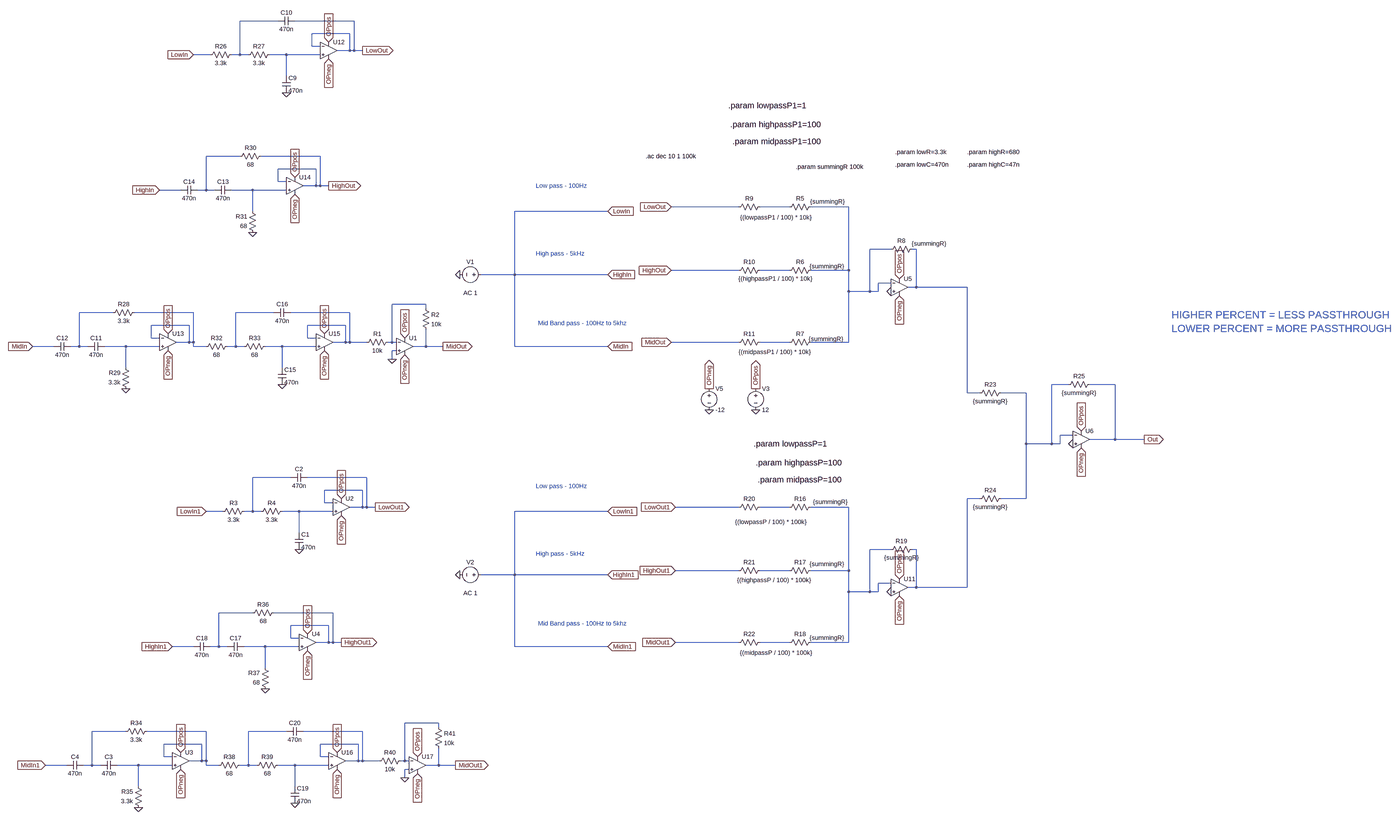
[diagram p0: schematic Analog 2 channel Audio Mixer.asc, whole sheet]
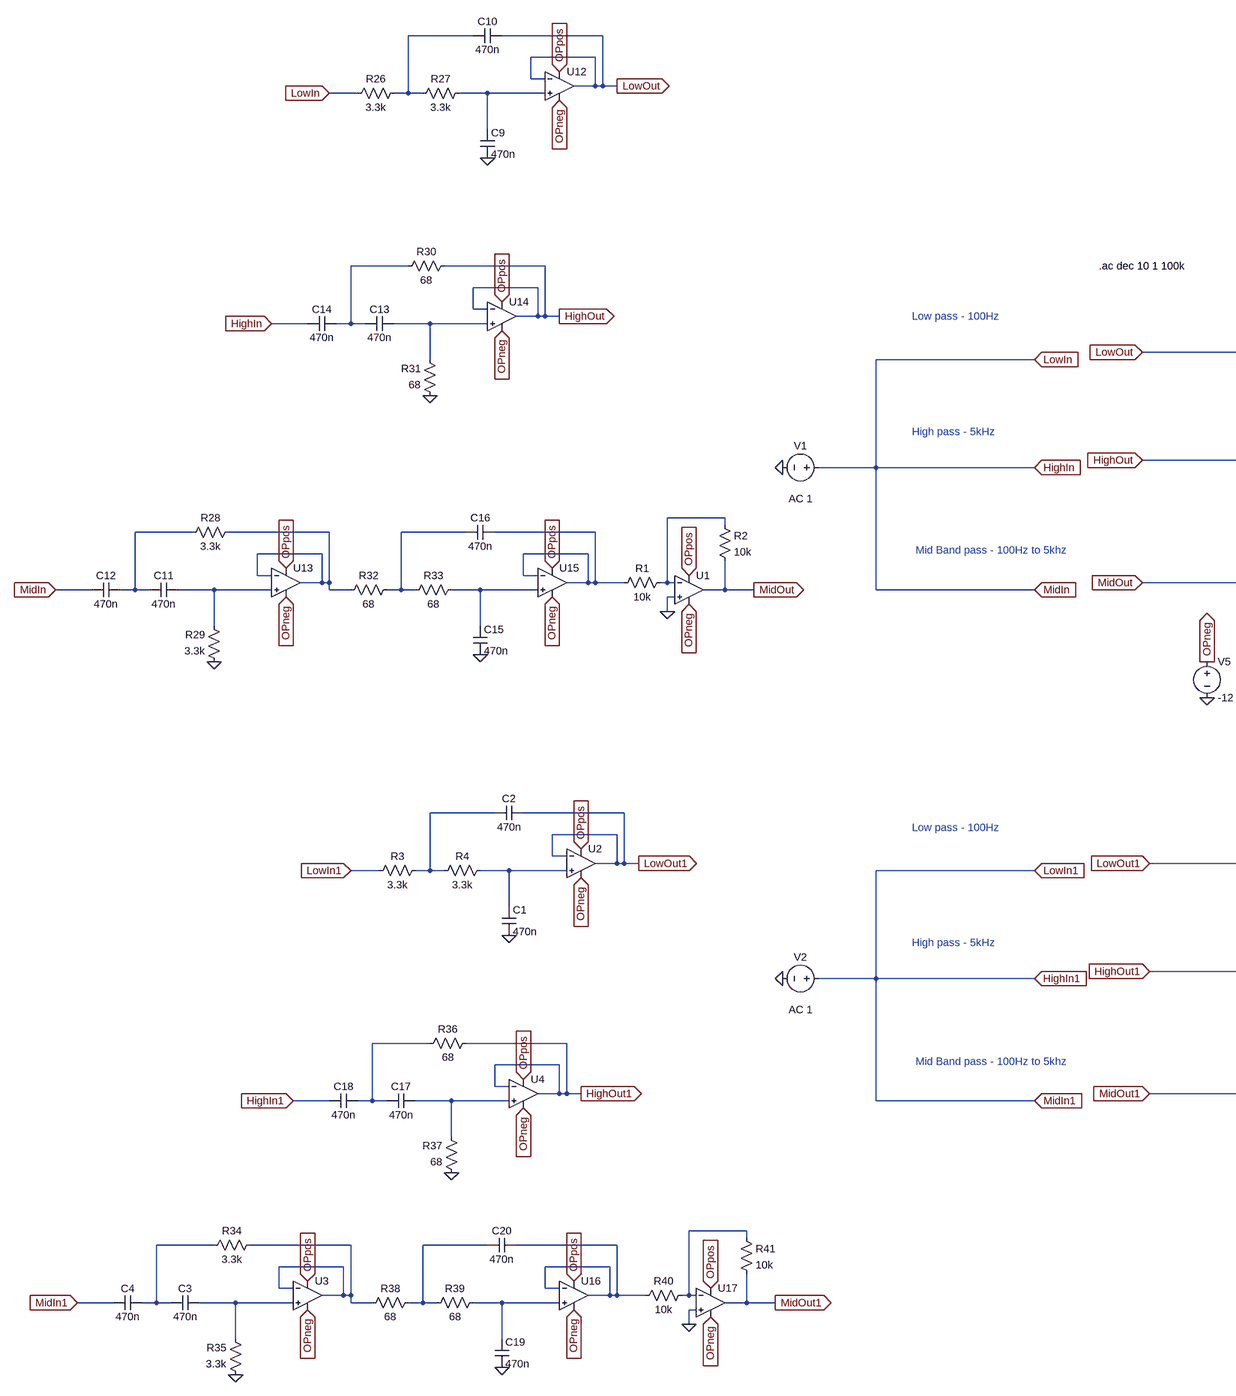
[diagram p1: schematic Analog 2 channel Audio Mixer.asc, part, row 1 of 1, column 1 of 2]
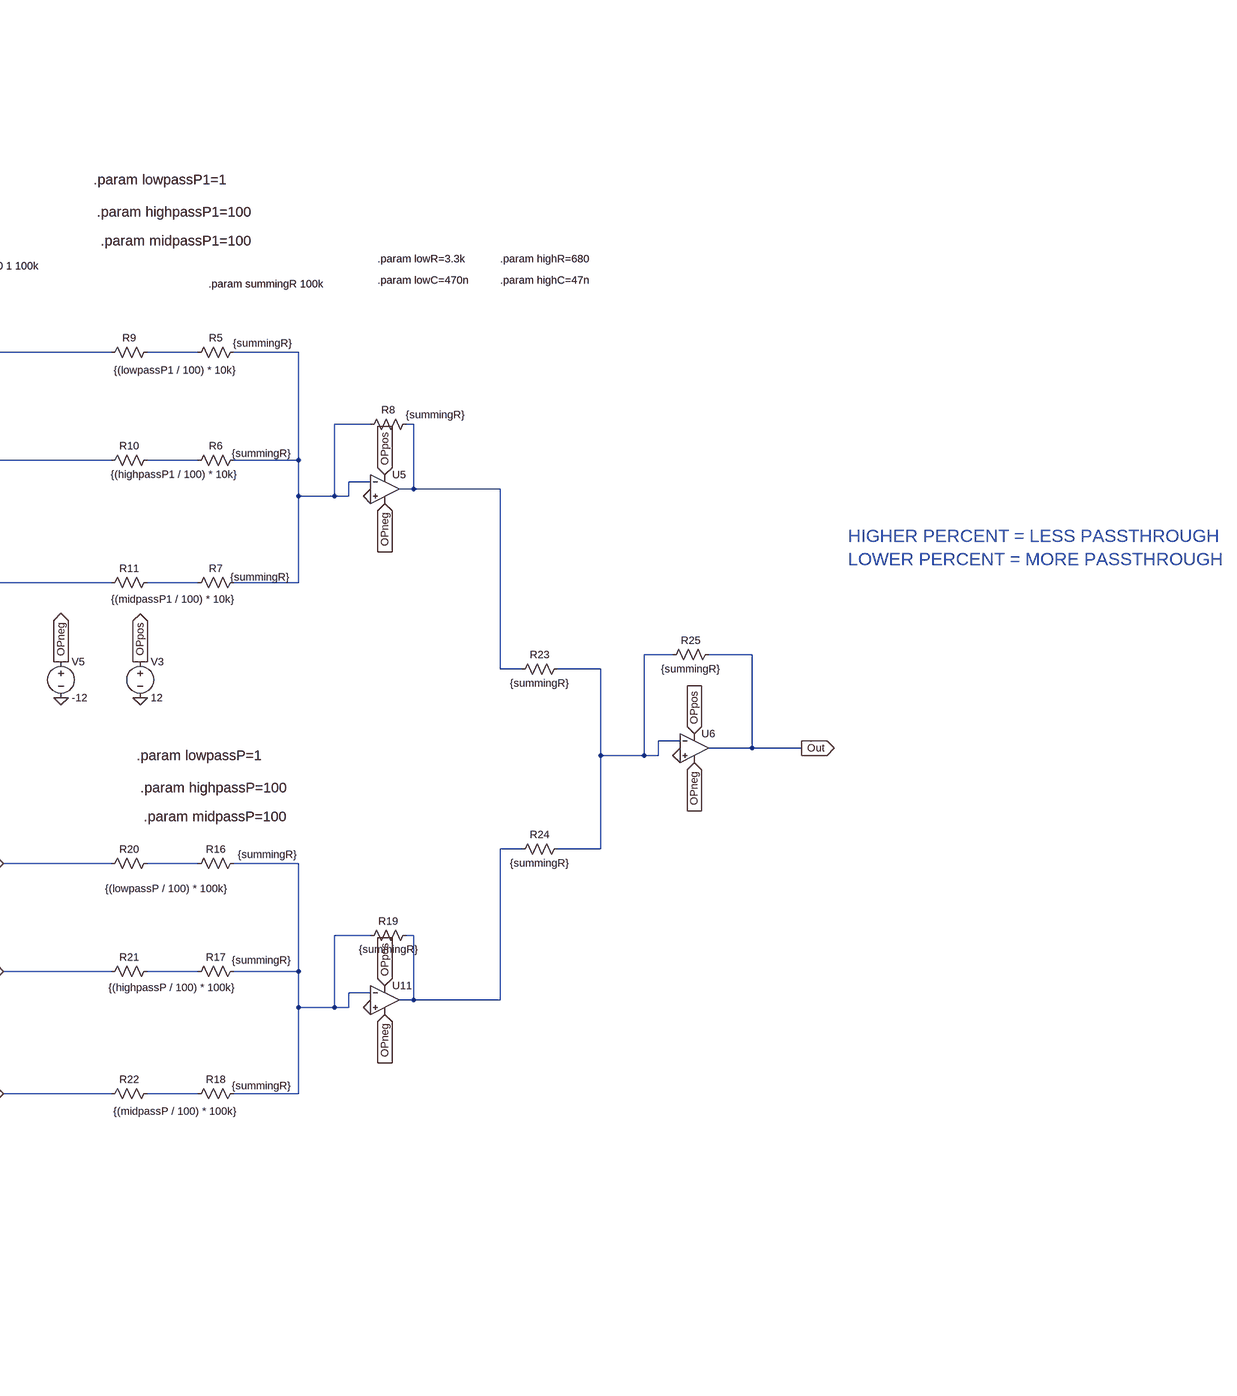
[diagram p2: schematic Analog 2 channel Audio Mixer.asc, part, row 1 of 1, column 2 of 2]
Analog 2 channel Audio Mixer.asc, the LTspice schematic file:
Version 4.1
SHEET 1 2996 2628
WIRE -1248 -512 -1392 -512
WIRE -960 -512 -1184 -512
WIRE -976 -464 -1120 -464
WIRE -1120 -416 -1120 -464
WIRE -1088 -416 -1120 -416
WIRE -976 -400 -976 -464
WIRE -976 -400 -1024 -400
WIRE -960 -400 -960 -512
WIRE -960 -400 -976 -400
WIRE -928 -400 -960 -400
WIRE -1504 -384 -1568 -384
WIRE -1392 -384 -1392 -512
WIRE -1392 -384 -1424 -384
WIRE -1360 -384 -1392 -384
WIRE -1216 -384 -1280 -384
WIRE -1088 -384 -1216 -384
WIRE -1216 -304 -1216 -384
WIRE -1392 0 -1520 0
WIRE -1088 0 -1312 0
WIRE -1104 48 -1248 48
WIRE -1248 96 -1248 48
WIRE -1216 96 -1248 96
WIRE -1104 112 -1104 48
WIRE -1104 112 -1152 112
WIRE -1088 112 -1088 0
WIRE -1088 112 -1104 112
WIRE -1056 112 -1088 112
WIRE -1616 128 -1696 128
WIRE -1520 128 -1520 0
WIRE -1520 128 -1552 128
WIRE -1488 128 -1520 128
WIRE -1344 128 -1424 128
WIRE -1216 128 -1344 128
WIRE 496 192 240 192
WIRE 688 192 576 192
WIRE 912 192 768 192
WIRE -1344 208 -1344 128
WIRE 0 208 -352 208
WIRE 1072 352 992 352
WIRE 1168 352 1152 352
WIRE 496 432 240 432
WIRE 688 432 576 432
WIRE 912 432 912 192
WIRE 912 432 768 432
WIRE -352 448 -352 208
WIRE -352 448 -480 448
WIRE 0 448 -352 448
WIRE 1072 480 1024 480
WIRE 1168 496 1168 352
WIRE 1168 496 1136 496
WIRE 1360 496 1168 496
WIRE 912 512 912 432
WIRE 992 512 992 352
WIRE 992 512 912 512
WIRE 1024 512 1024 480
WIRE 1024 512 992 512
WIRE -688 560 -816 560
WIRE -688 576 -688 560
WIRE -1872 592 -2000 592
WIRE -1568 592 -1792 592
WIRE -1264 592 -1408 592
WIRE -976 592 -1200 592
WIRE -1584 640 -1728 640
WIRE -992 640 -1136 640
WIRE -1728 688 -1728 640
WIRE -1696 688 -1728 688
WIRE -1136 688 -1136 640
WIRE -1104 688 -1136 688
WIRE -1584 704 -1584 640
WIRE -1584 704 -1632 704
WIRE -1568 704 -1568 592
WIRE -1568 704 -1584 704
WIRE -992 704 -992 640
WIRE -992 704 -1040 704
WIRE -976 704 -976 592
WIRE -976 704 -992 704
WIRE -912 704 -976 704
WIRE -816 704 -816 560
WIRE -816 704 -832 704
WIRE -800 704 -816 704
WIRE 496 704 240 704
WIRE 688 704 576 704
WIRE 912 704 912 512
WIRE 912 704 768 704
WIRE -2096 720 -2176 720
WIRE -2000 720 -2000 592
WIRE -2000 720 -2032 720
WIRE -1968 720 -2000 720
WIRE -1824 720 -1904 720
WIRE -1696 720 -1824 720
WIRE -1568 720 -1568 704
WIRE -1520 720 -1568 720
WIRE -1408 720 -1408 592
WIRE -1408 720 -1440 720
WIRE -1376 720 -1408 720
WIRE -1232 720 -1296 720
WIRE -1104 720 -1232 720
WIRE -688 720 -688 656
WIRE -688 720 -736 720
WIRE -624 720 -688 720
WIRE -352 720 -352 448
WIRE 0 720 -352 720
WIRE -800 736 -816 736
WIRE -816 768 -816 736
WIRE -1824 800 -1824 720
WIRE -1232 800 -1232 720
WIRE 1744 864 1680 864
WIRE 1920 864 1824 864
WIRE 1360 896 1360 496
WIRE 1408 896 1360 896
WIRE 1584 896 1488 896
WIRE 1760 1056 1712 1056
WIRE 1920 1072 1920 864
WIRE 1920 1072 1824 1072
WIRE 2080 1072 1920 1072
WIRE 1584 1088 1584 896
WIRE 1680 1088 1680 864
WIRE 1680 1088 1584 1088
WIRE 1712 1088 1712 1056
WIRE 1712 1088 1680 1088
WIRE -1200 1216 -1344 1216
WIRE -912 1216 -1136 1216
WIRE -928 1264 -1072 1264
WIRE 1408 1296 1360 1296
WIRE 1584 1296 1584 1088
WIRE 1584 1296 1488 1296
WIRE -1072 1312 -1072 1264
WIRE -1040 1312 -1072 1312
WIRE -928 1328 -928 1264
WIRE -928 1328 -976 1328
WIRE -912 1328 -912 1216
WIRE -912 1328 -928 1328
WIRE -880 1328 -912 1328
WIRE 496 1328 256 1328
WIRE 688 1328 576 1328
WIRE 912 1328 768 1328
WIRE -1456 1344 -1520 1344
WIRE -1344 1344 -1344 1216
WIRE -1344 1344 -1376 1344
WIRE -1312 1344 -1344 1344
WIRE -1168 1344 -1232 1344
WIRE -1040 1344 -1168 1344
WIRE 0 1344 -352 1344
WIRE -1168 1424 -1168 1344
WIRE 1072 1488 992 1488
WIRE 1168 1488 1152 1488
WIRE 496 1568 256 1568
WIRE 688 1568 576 1568
WIRE 912 1568 912 1328
WIRE 912 1568 768 1568
WIRE -352 1584 -352 1344
WIRE -352 1584 -480 1584
WIRE 0 1584 -352 1584
WIRE 1072 1616 1024 1616
WIRE 1168 1632 1168 1488
WIRE 1168 1632 1136 1632
WIRE 1360 1632 1360 1296
WIRE 1360 1632 1168 1632
WIRE 912 1648 912 1568
WIRE 992 1648 992 1488
WIRE 992 1648 912 1648
WIRE 1024 1648 1024 1616
WIRE 1024 1648 992 1648
WIRE -1344 1728 -1472 1728
WIRE -1040 1728 -1264 1728
WIRE -1056 1776 -1200 1776
WIRE -1200 1824 -1200 1776
WIRE -1168 1824 -1200 1824
WIRE -1056 1840 -1056 1776
WIRE -1056 1840 -1104 1840
WIRE -1040 1840 -1040 1728
WIRE -1040 1840 -1056 1840
WIRE -1008 1840 -1040 1840
WIRE 496 1840 256 1840
WIRE 688 1840 576 1840
WIRE 912 1840 912 1648
WIRE 912 1840 768 1840
WIRE -1568 1856 -1648 1856
WIRE -1472 1856 -1472 1728
WIRE -1472 1856 -1504 1856
WIRE -1440 1856 -1472 1856
WIRE -1296 1856 -1376 1856
WIRE -1168 1856 -1296 1856
WIRE -352 1856 -352 1584
WIRE 0 1856 -352 1856
WIRE -1296 1936 -1296 1856
WIRE -640 2288 -768 2288
WIRE -640 2304 -640 2288
WIRE -1824 2320 -1952 2320
WIRE -1520 2320 -1744 2320
WIRE -1216 2320 -1360 2320
WIRE -928 2320 -1152 2320
WIRE -1536 2368 -1680 2368
WIRE -944 2368 -1088 2368
WIRE -1680 2416 -1680 2368
WIRE -1648 2416 -1680 2416
WIRE -1088 2416 -1088 2368
WIRE -1056 2416 -1088 2416
WIRE -1536 2432 -1536 2368
WIRE -1536 2432 -1584 2432
WIRE -1520 2432 -1520 2320
WIRE -1520 2432 -1536 2432
WIRE -944 2432 -944 2368
WIRE -944 2432 -992 2432
WIRE -928 2432 -928 2320
WIRE -928 2432 -944 2432
WIRE -864 2432 -928 2432
WIRE -768 2432 -768 2288
WIRE -768 2432 -784 2432
WIRE -752 2432 -768 2432
WIRE -2048 2448 -2128 2448
WIRE -1952 2448 -1952 2320
WIRE -1952 2448 -1984 2448
WIRE -1920 2448 -1952 2448
WIRE -1776 2448 -1856 2448
WIRE -1648 2448 -1776 2448
WIRE -1520 2448 -1520 2432
WIRE -1472 2448 -1520 2448
WIRE -1360 2448 -1360 2320
WIRE -1360 2448 -1392 2448
WIRE -1328 2448 -1360 2448
WIRE -1184 2448 -1248 2448
WIRE -1056 2448 -1184 2448
WIRE -640 2448 -640 2384
WIRE -640 2448 -688 2448
WIRE -576 2448 -640 2448
WIRE -752 2464 -768 2464
WIRE -768 2496 -768 2464
WIRE -1776 2528 -1776 2448
WIRE -1184 2528 -1184 2448
FLAG -560 448 0
FLAG 560 960 0
FLAG 384 960 0
FLAG -560 1584 0
FLAG 2080 1072 Out
IOPIN 2080 1072 Out
FLAG -1216 -240 0
FLAG -1824 880 0
FLAG -1344 288 0
FLAG -1232 864 0
FLAG -1568 -384 LowIn
IOPIN -1568 -384 In
FLAG -1696 128 HighIn
IOPIN -1696 128 In
FLAG -2176 720 MidIn
IOPIN -2176 720 In
FLAG -928 -400 LowOut
IOPIN -928 -400 Out
FLAG -1056 112 HighOut
IOPIN -1056 112 Out
FLAG -624 720 MidOut
IOPIN -624 720 Out
FLAG -1184 80 OPpos
IOPIN -1184 80 In
FLAG -1184 144 OPneg
IOPIN -1184 144 In
FLAG -1664 672 OPpos
IOPIN -1664 672 In
FLAG -1664 736 OPneg
IOPIN -1664 736 In
FLAG -1072 736 OPneg
IOPIN -1072 736 In
FLAG -1072 672 OPpos
IOPIN -1072 672 In
FLAG -1056 -432 OPpos
IOPIN -1056 -432 In
FLAG -1056 -368 OPneg
IOPIN -1056 -368 In
FLAG 0 208 LowIn
IOPIN 0 208 In
FLAG 240 192 LowOut
IOPIN 240 192 In
FLAG 0 448 HighIn
IOPIN 0 448 In
FLAG 240 432 HighOut
IOPIN 240 432 In
FLAG 0 720 MidIn
IOPIN 0 720 In
FLAG 240 704 MidOut
IOPIN 240 704 In
FLAG 560 880 OPpos
IOPIN 560 880 Out
FLAG 384 880 OPneg
IOPIN 384 880 Out
FLAG -768 752 OPneg
IOPIN -768 752 In
FLAG -768 688 OPpos
IOPIN -768 688 In
FLAG -816 768 0
FLAG -1168 1488 0
FLAG -1776 2608 0
FLAG -1296 2016 0
FLAG -1184 2592 0
FLAG -1520 1344 LowIn1
IOPIN -1520 1344 In
FLAG -1648 1856 HighIn1
IOPIN -1648 1856 In
FLAG -2128 2448 MidIn1
IOPIN -2128 2448 In
FLAG -880 1328 LowOut1
IOPIN -880 1328 Out
FLAG -1008 1840 HighOut1
IOPIN -1008 1840 Out
FLAG -576 2448 MidOut1
IOPIN -576 2448 Out
FLAG -1136 1808 OPpos
IOPIN -1136 1808 In
FLAG -1136 1872 OPneg
IOPIN -1136 1872 In
FLAG -1616 2400 OPpos
IOPIN -1616 2400 In
FLAG -1616 2464 OPneg
IOPIN -1616 2464 In
FLAG -1024 2464 OPneg
IOPIN -1024 2464 In
FLAG -1024 2400 OPpos
IOPIN -1024 2400 In
FLAG -1008 1296 OPpos
IOPIN -1008 1296 In
FLAG -1008 1360 OPneg
IOPIN -1008 1360 In
FLAG -720 2480 OPneg
IOPIN -720 2480 In
FLAG -720 2416 OPpos
IOPIN -720 2416 In
FLAG -768 2496 0
FLAG 1104 1664 OPneg
IOPIN 1104 1664 In
FLAG 1792 1104 OPneg
IOPIN 1792 1104 In
FLAG 1104 1600 OPpos
IOPIN 1104 1600 In
FLAG 1792 1040 OPpos
IOPIN 1792 1040 In
FLAG 1104 464 OPpos
IOPIN 1104 464 In
FLAG 1104 528 OPneg
IOPIN 1104 528 In
FLAG 0 1344 LowIn1
IOPIN 0 1344 In
FLAG 0 1584 HighIn1
IOPIN 0 1584 In
FLAG 0 1856 MidIn1
IOPIN 0 1856 In
FLAG 256 1328 LowOut1
IOPIN 256 1328 In
FLAG 256 1568 HighOut1
IOPIN 256 1568 In
FLAG 256 1840 MidOut1
IOPIN 256 1840 In
FLAG 1072 512 0
FLAG 1072 1648 0
FLAG 1760 1088 0
SYMBOL Voltage -464 448 R90
WINDOW 0 -32 56 VBottom 2
WINDOW 3 32 56 VTop 2
WINDOW 123 54 56 VTop 2
SYMATTR InstName V1
SYMATTR Value ""
SYMATTR Value2 AC 1
SYMBOL Res 784 176 R90
WINDOW 0 0 56 VBottom 2
WINDOW 3 -20 -48 VTop 2
SYMATTR InstName R5
SYMATTR Value {summingR}
SYMBOL Res 784 416 R90
WINDOW 0 0 56 VBottom 2
WINDOW 3 -15 -46 VTop 2
SYMATTR InstName R6
SYMATTR Value {summingR}
SYMBOL Res 784 688 R90
WINDOW 0 0 56 VBottom 2
WINDOW 3 -12 -42 VTop 2
SYMATTR InstName R7
SYMATTR Value {summingR}
SYMBOL OpAmps/UniversalOpAmp 1104 496 R0
SYMATTR InstName U5
SYMBOL Res 1168 336 R90
WINDOW 0 0 56 VBottom 2
WINDOW 3 -21 -48 VTop 2
SYMATTR InstName R8
SYMATTR Value {summingR}
SYMBOL Res 592 176 R90
WINDOW 0 0 56 VBottom 2
WINDOW 3 40 -45 VTop 2
SYMATTR InstName R9
SYMATTR Value {(lowpassP1 / 100) * 10k}
SYMBOL Res 592 416 R90
WINDOW 0 0 56 VBottom 2
WINDOW 3 32 -43 VTop 2
SYMATTR InstName R10
SYMATTR Value {(highpassP1 / 100) * 10k}
SYMBOL Res 592 688 R90
WINDOW 0 0 56 VBottom 2
WINDOW 3 37 -41 VTop 2
SYMATTR InstName R11
SYMATTR Value {(midpassP1 / 100) * 10k}
SYMBOL Voltage 560 864 R0
SYMATTR InstName V3
SYMATTR Value 12
SYMBOL Voltage 384 864 R0
SYMATTR InstName V5
SYMATTR Value -12
SYMBOL OpAmps/UniversalOpAmp 1792 1072 R0
SYMATTR InstName U6
SYMBOL Voltage -464 1584 R90
WINDOW 0 -32 56 VBottom 2
WINDOW 3 32 56 VTop 2
WINDOW 123 54 56 VTop 2
WINDOW 39 0 0 Left 0
SYMATTR InstName V2
SYMATTR Value ""
SYMATTR Value2 AC 1
SYMBOL Res 784 1312 R90
WINDOW 0 0 56 VBottom 2
WINDOW 3 -19 -59 VTop 2
SYMATTR InstName R16
SYMATTR Value {summingR}
SYMBOL Res 784 1552 R90
WINDOW 0 0 56 VBottom 2
WINDOW 3 -24 -46 VTop 2
SYMATTR InstName R17
SYMATTR Value {summingR}
SYMBOL Res 784 1824 R90
WINDOW 0 0 56 VBottom 2
WINDOW 3 -17 -46 VTop 2
SYMATTR InstName R18
SYMATTR Value {summingR}
SYMBOL OpAmps/UniversalOpAmp 1104 1632 R0
SYMATTR InstName U11
SYMBOL Res 1168 1472 R90
WINDOW 0 0 56 VBottom 2
WINDOW 3 32 56 VTop 2
SYMATTR InstName R19
SYMATTR Value {summingR}
SYMBOL Res 592 1312 R90
WINDOW 0 0 56 VBottom 2
WINDOW 3 57 -26 VTop 2
SYMATTR InstName R20
SYMATTR Value {(lowpassP / 100) * 100k}
SYMBOL Res 592 1552 R90
WINDOW 0 0 56 VBottom 2
WINDOW 3 37 -38 VTop 2
SYMATTR InstName R21
SYMATTR Value {(highpassP / 100) * 100k}
SYMBOL Res 592 1824 R90
WINDOW 0 0 56 VBottom 2
WINDOW 3 40 -46 VTop 2
SYMATTR InstName R22
SYMATTR Value {(midpassP / 100) * 100k}
SYMBOL Res 1504 880 R90
WINDOW 0 0 56 VBottom 2
WINDOW 3 32 56 VTop 2
SYMATTR InstName R23
SYMATTR Value {summingR}
SYMBOL Res 1504 1280 R90
WINDOW 0 0 56 VBottom 2
WINDOW 3 32 56 VTop 2
SYMATTR InstName R24
SYMATTR Value {summingR}
SYMBOL Res 1840 848 R90
WINDOW 0 0 56 VBottom 2
WINDOW 3 32 56 VTop 2
SYMATTR InstName R25
SYMATTR Value {summingR}
SYMBOL res -1408 -400 R90
WINDOW 0 0 56 VBottom 2
WINDOW 3 32 56 VTop 2
SYMATTR InstName R26
SYMATTR Value 3.3k
SYMBOL res -1264 -400 R90
WINDOW 0 0 56 VBottom 2
WINDOW 3 32 56 VTop 2
SYMATTR InstName R27
SYMATTR Value 3.3k
SYMBOL cap -1232 -304 R0
SYMATTR InstName C9
SYMATTR Value 470n
SYMBOL cap -1184 -528 R90
WINDOW 0 0 32 VBottom 2
WINDOW 3 32 32 VTop 2
SYMATTR InstName C10
SYMATTR Value 470n
SYMBOL OpAmps/UniversalOpAmp -1056 -400 R0
SYMATTR InstName U12
SYMBOL res -1776 576 R90
WINDOW 0 0 56 VBottom 2
WINDOW 3 32 56 VTop 2
SYMATTR InstName R28
SYMATTR Value 3.3k
SYMBOL res -1808 896 R180
WINDOW 0 36 76 Left 2
WINDOW 3 36 40 Left 2
SYMATTR InstName R29
SYMATTR Value 3.3k
SYMBOL cap -1904 704 R90
WINDOW 0 0 32 VBottom 2
WINDOW 3 32 32 VTop 2
SYMATTR InstName C11
SYMATTR Value 470n
SYMBOL cap -2032 704 R90
WINDOW 0 0 32 VBottom 2
WINDOW 3 32 32 VTop 2
SYMATTR InstName C12
SYMATTR Value 470n
SYMBOL OpAmps/UniversalOpAmp -1664 704 R0
SYMATTR InstName U13
SYMBOL res -1296 -16 R90
WINDOW 0 0 56 VBottom 2
WINDOW 3 32 56 VTop 2
SYMATTR InstName R30
SYMATTR Value 68
SYMBOL res -1328 304 R180
WINDOW 0 36 76 Left 2
WINDOW 3 36 40 Left 2
SYMATTR InstName R31
SYMATTR Value 68
SYMBOL cap -1424 112 R90
WINDOW 0 0 32 VBottom 2
WINDOW 3 32 32 VTop 2
SYMATTR InstName C13
SYMATTR Value 470n
SYMBOL cap -1552 112 R90
WINDOW 0 0 32 VBottom 2
WINDOW 3 32 32 VTop 2
SYMATTR InstName C14
SYMATTR Value 470n
SYMBOL OpAmps/UniversalOpAmp -1184 112 R0
SYMATTR InstName U14
SYMBOL res -1424 704 R90
WINDOW 0 0 56 VBottom 2
WINDOW 3 32 56 VTop 2
SYMATTR InstName R32
SYMATTR Value 68
SYMBOL res -1280 704 R90
WINDOW 0 0 56 VBottom 2
WINDOW 3 32 56 VTop 2
SYMATTR InstName R33
SYMATTR Value 68
SYMBOL cap -1248 800 R0
SYMATTR InstName C15
SYMATTR Value 470n
SYMBOL cap -1200 576 R90
WINDOW 0 0 32 VBottom 2
WINDOW 3 32 32 VTop 2
SYMATTR InstName C16
SYMATTR Value 470n
SYMBOL OpAmps/UniversalOpAmp -1072 704 R0
SYMATTR InstName U15
SYMBOL OpAmps/UniversalOpAmp -768 720 R0
SYMATTR InstName U1
SYMBOL res -816 688 R90
WINDOW 0 0 56 VBottom 2
WINDOW 3 32 56 VTop 2
SYMATTR InstName R1
SYMATTR Value 10k
SYMBOL res -704 560 R0
SYMATTR InstName R2
SYMATTR Value 10k
SYMBOL res -1360 1328 R90
WINDOW 0 0 56 VBottom 2
WINDOW 3 32 56 VTop 2
SYMATTR InstName R3
SYMATTR Value 3.3k
SYMBOL res -1216 1328 R90
WINDOW 0 0 56 VBottom 2
WINDOW 3 32 56 VTop 2
SYMATTR InstName R4
SYMATTR Value 3.3k
SYMBOL cap -1184 1424 R0
SYMATTR InstName C1
SYMATTR Value 470n
SYMBOL cap -1136 1200 R90
WINDOW 0 0 32 VBottom 2
WINDOW 3 32 32 VTop 2
SYMATTR InstName C2
SYMATTR Value 470n
SYMBOL OpAmps/UniversalOpAmp -1008 1328 R0
SYMATTR InstName U2
SYMBOL res -1728 2304 R90
WINDOW 0 0 56 VBottom 2
WINDOW 3 32 56 VTop 2
SYMATTR InstName R34
SYMATTR Value 3.3k
SYMBOL res -1760 2624 R180
WINDOW 0 36 76 Left 2
WINDOW 3 36 40 Left 2
SYMATTR InstName R35
SYMATTR Value 3.3k
SYMBOL cap -1856 2432 R90
WINDOW 0 0 32 VBottom 2
WINDOW 3 32 32 VTop 2
SYMATTR InstName C3
SYMATTR Value 470n
SYMBOL cap -1984 2432 R90
WINDOW 0 0 32 VBottom 2
WINDOW 3 32 32 VTop 2
SYMATTR InstName C4
SYMATTR Value 470n
SYMBOL OpAmps/UniversalOpAmp -1616 2432 R0
SYMATTR InstName U3
SYMBOL res -1248 1712 R90
WINDOW 0 0 56 VBottom 2
WINDOW 3 32 56 VTop 2
SYMATTR InstName R36
SYMATTR Value 68
SYMBOL res -1280 2032 R180
WINDOW 0 36 76 Left 2
WINDOW 3 36 40 Left 2
SYMATTR InstName R37
SYMATTR Value 68
SYMBOL cap -1376 1840 R90
WINDOW 0 0 32 VBottom 2
WINDOW 3 32 32 VTop 2
SYMATTR InstName C17
SYMATTR Value 470n
SYMBOL cap -1504 1840 R90
WINDOW 0 0 32 VBottom 2
WINDOW 3 32 32 VTop 2
SYMATTR InstName C18
SYMATTR Value 470n
SYMBOL OpAmps/UniversalOpAmp -1136 1840 R0
SYMATTR InstName U4
SYMBOL res -1376 2432 R90
WINDOW 0 0 56 VBottom 2
WINDOW 3 32 56 VTop 2
SYMATTR InstName R38
SYMATTR Value 68
SYMBOL res -1232 2432 R90
WINDOW 0 0 56 VBottom 2
WINDOW 3 32 56 VTop 2
SYMATTR InstName R39
SYMATTR Value 68
SYMBOL cap -1200 2528 R0
SYMATTR InstName C19
SYMATTR Value 470n
SYMBOL cap -1152 2304 R90
WINDOW 0 0 32 VBottom 2
WINDOW 3 32 32 VTop 2
SYMATTR InstName C20
SYMATTR Value 470n
SYMBOL OpAmps/UniversalOpAmp -1024 2432 R0
SYMATTR InstName U16
SYMBOL OpAmps/UniversalOpAmp -720 2448 R0
SYMATTR InstName U17
SYMBOL res -768 2416 R90
WINDOW 0 0 56 VBottom 2
WINDOW 3 32 56 VTop 2
SYMATTR InstName R40
SYMATTR Value 10k
SYMBOL res -656 2288 R0
SYMATTR InstName R41
SYMATTR Value 10k
TEXT 712 40 Left 2 !.param summingR 100k
TEXT -272 112 Left 2 ;Low pass - 100Hz
TEXT -272 368 Left 2 ;High pass - 5kHz
TEXT -264 632 Left 2 ;Mid Band pass - 100Hz to 5khz
TEXT 144 0 Left 2 !.ac dec 10 1 100k
TEXT -272 1248 Left 2 ;Low pass - 100Hz
TEXT -272 1504 Left 2 ;High pass - 5kHz
TEXT -264 1768 Left 2 ;Mid Band pass - 100Hz to 5khz
TEXT 552 1088 Left 3 !.param lowpassP=1
TEXT 560 1160 Left 3 !.param highpassP=100
TEXT 568 1224 Left 3 !.param midpassP=100
TEXT 456 -192 Left 3 !.param lowpassP1=1
TEXT 464 -120 Left 3 !.param highpassP1=100
TEXT 472 -56 Left 3 !.param midpassP1=100
TEXT 2184 600 Left 4 ;HIGHER PERCENT = LESS PASSTHROUGH\nLOWER PERCENT = MORE PASSTHROUGH
TEXT 1088 -16 Left 2 !.param lowR=3.3k
TEXT 1360 -16 Left 2 !.param highR=680
TEXT 1088 32 Left 2 !.param lowC=470n
TEXT 1360 32 Left 2 !.param highC=47n

The netlist it stands for:
* Analog 2 channel Audio Mixer.asc
V1 MidIn 0 AC 1
R5 N006 N005 {summingR}
R6 N006 N008 {summingR}
R7 N006 N014 {summingR}
X§U5 0 N006 OPpos OPneg N007 level1 Avol=1Meg GBW=10Meg Vos=0 En=0 Enk=0 In=0 Ink=0 Rin=500Meg  ; pins In+ In- V+ V- OUT
R8 N007 N006 {summingR}
R9 N005 LowOut {(lowpassP1 / 100) * 10k}
R10 N008 HighOut {(highpassP1 / 100) * 10k}
R11 N014 MidOut {(midpassP1 / 100) * 10k}
V3 OPpos 0 12
V5 OPneg 0 -12
X§U6 0 N017 OPpos OPneg Out level1 Avol=1Meg GBW=10Meg Vos=0 En=0 Enk=0 In=0 Ink=0 Rin=500Meg  ; pins In+ In- V+ V- OUT
V2 MidIn1 0 AC 1
R16 N021 N020 {summingR}
R17 N021 N023 {summingR}
R18 N021 N025 {summingR}
X§U11 0 N021 OPpos OPneg N019 level1 Avol=1Meg GBW=10Meg Vos=0 En=0 Enk=0 In=0 Ink=0 Rin=500Meg  ; pins In+ In- V+ V- OUT
R19 N019 N021 {summingR}
R20 N020 LowOut1 {(lowpassP / 100) * 100k}
R21 N023 HighOut1 {(highpassP / 100) * 100k}
R22 N025 MidOut1 {(midpassP / 100) * 100k}
R23 N017 N007 {summingR}
R24 N017 N019 {summingR}
R25 Out N017 {summingR}
R26 N001 MidIn 3.3k
R27 N002 N001 3.3k
C9 N002 0 470n
C10 LowOut N001 470n
X§U12 N002 LowOut OPpos OPneg LowOut level1 Avol=1Meg GBW=10Meg Vos=0 En=0 Enk=0 In=0 Ink=0 Rin=500Meg  ; pins In+ In- V+ V- OUT
R28 N011 N010 3.3k
R29 0 N015 3.3k
C11 N015 N010 470n
C12 N010 MidIn 470n
X§U13 N015 N011 OPpos OPneg N011 level1 Avol=1Meg GBW=10Meg Vos=0 En=0 Enk=0 In=0 Ink=0 Rin=500Meg  ; pins In+ In- V+ V- OUT
R30 HighOut N003 68
R31 0 N004 68
C13 N004 N003 470n
C14 N003 MidIn 470n
X§U14 N004 HighOut OPpos OPneg HighOut level1 Avol=1Meg GBW=10Meg Vos=0 En=0 Enk=0 In=0 Ink=0 Rin=500Meg  ; pins In+ In- V+ V- OUT
R32 N012 N011 68
R33 N016 N012 68
C15 N016 0 470n
C16 N013 N012 470n
X§U15 N016 N013 OPpos OPneg N013 level1 Avol=1Meg GBW=10Meg Vos=0 En=0 Enk=0 In=0 Ink=0 Rin=500Meg  ; pins In+ In- V+ V- OUT
X§U1 0 N009 OPpos OPneg MidOut level1 Avol=1Meg GBW=10Meg Vos=0 En=0 Enk=0 In=0 Ink=0 Rin=500Meg  ; pins In+ In- V+ V- OUT
R1 N009 N013 10k
R2 N009 MidOut 10k
R3 N018 MidIn1 3.3k
R4 N022 N018 3.3k
C1 N022 0 470n
C2 LowOut1 N018 470n
X§U2 N022 LowOut1 OPpos OPneg LowOut1 level1 Avol=1Meg GBW=10Meg Vos=0 En=0 Enk=0 In=0 Ink=0 Rin=500Meg  ; pins In+ In- V+ V- OUT
R34 N029 N028 3.3k
R35 0 N032 3.3k
C3 N032 N028 470n
C4 N028 MidIn1 470n
X§U3 N032 N029 OPpos OPneg N029 level1 Avol=1Meg GBW=10Meg Vos=0 En=0 Enk=0 In=0 Ink=0 Rin=500Meg  ; pins In+ In- V+ V- OUT
R36 HighOut1 N024 68
R37 0 N026 68
C17 N026 N024 470n
C18 N024 MidIn1 470n
X§U4 N026 HighOut1 OPpos OPneg HighOut1 level1 Avol=1Meg GBW=10Meg Vos=0 En=0 Enk=0 In=0 Ink=0 Rin=500Meg  ; pins In+ In- V+ V- OUT
R38 N030 N029 68
R39 N033 N030 68
C19 N033 0 470n
C20 N031 N030 470n
X§U16 N033 N031 OPpos OPneg N031 level1 Avol=1Meg GBW=10Meg Vos=0 En=0 Enk=0 In=0 Ink=0 Rin=500Meg  ; pins In+ In- V+ V- OUT
X§U17 0 N027 OPpos OPneg MidOut1 level1 Avol=1Meg GBW=10Meg Vos=0 En=0 Enk=0 In=0 Ink=0 Rin=500Meg  ; pins In+ In- V+ V- OUT
R40 N027 N031 10k
R41 N027 MidOut1 10k
.param summingR 100k
* Low pass - 100Hz
* High pass - 5kHz
* Mid Band pass - 100Hz to 5khz
.ac dec 10 1 100k
* Low pass - 100Hz
* High pass - 5kHz
* Mid Band pass - 100Hz to 5khz
.param lowpassP=1
.param highpassP=100
.param midpassP=100
.param lowpassP1=1
.param highpassP1=100
.param midpassP1=100
* HIGHER PERCENT = LESS PASSTHROUGH
* LOWER PERCENT = MORE PASSTHROUGH
.param lowR=3.3k
.param highR=680
.param lowC=470n
.param highC=47n
.lib UniversalOpAmp1.lib
.backanno
.end